# Altium project ButtonBoard.PrjPCB
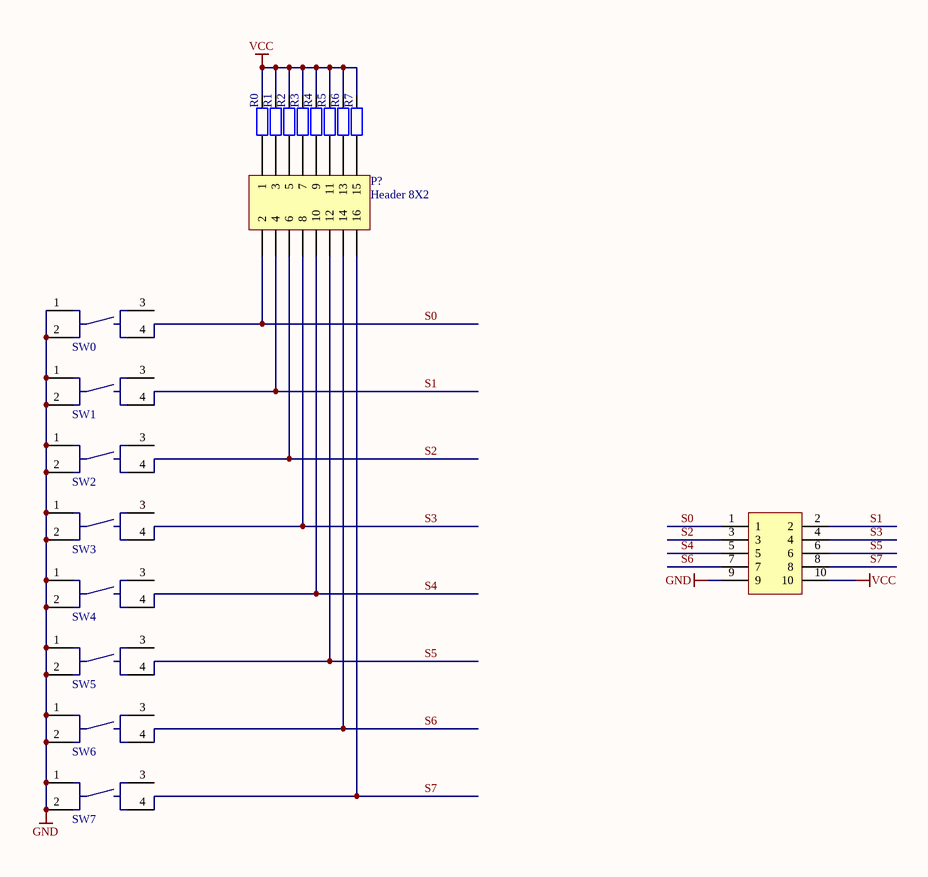
[diagram p0: ButtonBoard.SchDoc]
1 sheet, 18 parts. Net scope: global (net labels, ports and power ports of the same name join across sheets).
Board file: ButtonBoard.PcbDoc

## Sheet ButtonBoard.SchDoc
size A4

### Parts
P?  Header 8X2  [HDR2X8]
R0  Res2  [6-0805_M]  (value not drawn)
R1  Res2  [6-0805_M]  (value not drawn)
R2  Res2  [6-0805_M]  (value not drawn)
R3  Res2  [6-0805_M]  (value not drawn)
R4  Res2  [6-0805_M]  (value not drawn)
R5  Res2  [6-0805_M]  (value not drawn)
R6  Res2  [6-0805_M]  (value not drawn)
R7  Res2  [6-0805_M]  (value not drawn)
SW0  Generic SMD Switch  [SMD Switch]  (value not drawn)
SW1  Generic SMD Switch  [SMD Switch]  (value not drawn)
SW2  Generic SMD Switch  [SMD Switch]  (value not drawn)
SW3  Generic SMD Switch  [SMD Switch]  (value not drawn)
SW4  Generic SMD Switch  [SMD Switch]  (value not drawn)
SW5  Generic SMD Switch  [SMD Switch]  (value not drawn)
SW6  Generic SMD Switch  [SMD Switch]  (value not drawn)
SW7  Generic SMD Switch  [SMD Switch]  (value not drawn)
  10 pol Header  [10 pol Header]  (value not drawn)

### Nets
GND: SW0.1 SW0.2 SW1.1 SW1.2 SW2.1 SW2.2 SW3.1 SW3.2 SW4.1 SW4.2 SW5.1 SW5.2 SW6.1 SW6.2 SW7.1 SW7.2 .9
VCC: R0.1 R1.1 R2.1 R3.1 R4.1 R5.1 R6.1 R7.1 .10
S0: P?.2 SW0.4 .1
S1: P?.4 SW1.4 .2
S2: P?.6 SW2.4 .3
S3: P?.8 SW3.4 .4
S4: P?.10 SW4.4 .5
S5: P?.12 SW5.4 .6
S6: P?.14 SW6.4 .7
S7: P?.16 SW7.4 .8
NetP?_1: P?.1 R0.2
NetP?_3: P?.3 R1.2
NetP?_5: P?.5 R2.2
NetP?_7: P?.7 R3.2
NetP?_9: P?.9 R4.2
NetP?_11: P?.11 R5.2
NetP?_13: P?.13 R6.2
NetP?_15: P?.15 R7.2

Not connected (* = marked no-connect by the designer): SW0 3; SW1 3; SW2 3; SW3 3; SW4 3; SW5 3; SW6 3; SW7 3

### Library data of the parts
P? = Header 8X2: Header, 8-Pin, Dual row; LatestRevisionDate: 17-Jul-2002; LatestRevisionNote: Re-released for DXP Platform.; Publisher: Altium Limited
R0-R7 = Res2: Resistor; Published: 8-Jun-2000; LatestRevisionDate: 17-Jul-2002; LatestRevisionNote: Re-released for DXP Platform.; PackageReference: AXIAL-0.4; Publisher: Altium Limited; PackageDescription: Axial Device, Thru-Hole; 2 Leads; 0.4 in Pin Spacing
? = 10 pol Header: LatestRevisionDate: 2012-06-14; Publisher: NONLINEAR LABS
SW0-SW7 = Generic SMD Switch: Published: 2012-06-19; Publisher: NONLINEAR LABS